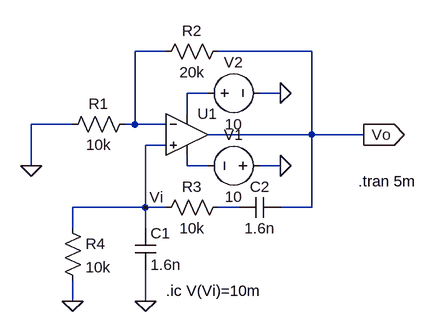
[diagram p0: schematic P2c.asc]
P2c.asc, the LTspice schematic file:
Version 4.1
SHEET 1 880 680
WIRE 176 32 128 32
WIRE 400 32 256 32
WIRE 240 96 208 96
WIRE 352 96 320 96
WIRE 208 128 208 96
WIRE 32 144 -32 144
WIRE 128 144 128 32
WIRE 128 144 112 144
WIRE 176 144 128 144
WIRE 400 160 400 32
WIRE 400 160 240 160
WIRE 480 160 400 160
WIRE 176 176 144 176
WIRE -32 208 -32 144
WIRE 208 208 208 192
WIRE 240 208 208 208
WIRE 352 208 320 208
WIRE 144 272 144 176
WIRE 144 272 32 272
WIRE 176 272 144 272
WIRE 288 272 256 272
WIRE 400 272 400 160
WIRE 400 272 352 272
WIRE 32 304 32 272
WIRE 144 304 144 272
WIRE 32 416 32 384
WIRE 144 416 144 368
FLAG -32 208 0
FLAG 32 416 0
FLAG 144 416 0
FLAG 480 160 Vo
IOPIN 480 160 Out
FLAG 352 96 0
FLAG 352 208 0
FLAG 144 272 Vi
SYMBOL OpAmps\\UniversalOpAmp2 208 160 R0
SYMATTR InstName U1
SYMBOL res 128 128 R90
WINDOW 0 0 56 VBottom 2
WINDOW 3 32 56 VTop 2
SYMATTR InstName R1
SYMATTR Value 10k
SYMBOL res 272 16 R90
WINDOW 0 0 56 VBottom 2
WINDOW 3 32 56 VTop 2
SYMATTR InstName R2
SYMATTR Value 20k
SYMBOL res 272 256 R90
WINDOW 0 0 56 VBottom 2
WINDOW 3 32 56 VTop 2
SYMATTR InstName R3
SYMATTR Value 10k
SYMBOL cap 128 304 R0
SYMATTR InstName C1
SYMATTR Value 1.6n
SYMBOL cap 352 256 R90
WINDOW 0 0 32 VBottom 2
WINDOW 3 32 32 VTop 2
SYMATTR InstName C2
SYMATTR Value 1.6n
SYMBOL res 16 288 R0
SYMATTR InstName R4
SYMATTR Value 10k
SYMBOL voltage 336 208 R90
WINDOW 0 -32 56 VBottom 2
WINDOW 3 32 56 VTop 2
WINDOW 123 0 0 Left 0
WINDOW 39 0 0 Left 0
SYMATTR InstName V1
SYMATTR Value 10
SYMBOL voltage 224 96 R270
WINDOW 0 32 56 VTop 2
WINDOW 3 -32 56 VBottom 2
WINDOW 123 0 0 Left 0
WINDOW 39 0 0 Left 0
SYMATTR InstName V2
SYMATTR Value 10
TEXT 176 400 Left 2 !.ic V(Vi)=10m
TEXT 472 232 Left 2 !.tran 5m

The netlist it stands for:
* P2c.asc
X§U1 Vi N001 N002 N003 Vo level2 Avol=1Meg GBW=10Meg Slew=10Meg Ilimit=25m Rail=0 Vos=0 En=0 Enk=0 In=0 Ink=0 Rin=500Meg  ; pins In+ In- V+ V- OUT
R1 N001 0 10k
R2 Vo N001 20k
R3 N004 Vi 10k
C1 Vi 0 1.6n
C2 Vo N004 1.6n
R4 Vi 0 10k
V1 0 N003 10
V2 N002 0 10
.ic V(Vi)=10m
.tran 5m
.lib UniversalOpAmp2.lib
.backanno
.end